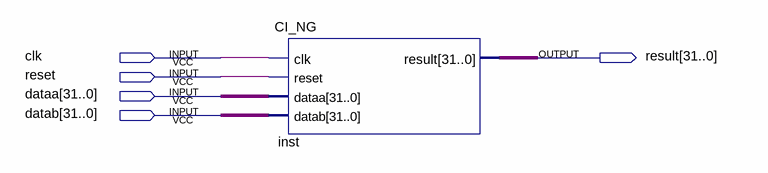
[diagram p0: schematic sheet]
// Quartus schematic NG_Controller_Klem.bdf as structural Verilog: 1 symbols, 5 pins
module NG_Controller_Klem (
  input  clk,
  input  reset,
  input  [31:0] dataa,
  input  [31:0] datab,
  output [31:0] result
);

  CI_NG inst (.clk(clk), .reset(reset), .dataa(dataa), .datab(datab), .result(result));
endmodule
